# Altium schematic sheet main.SchDoc
size A4
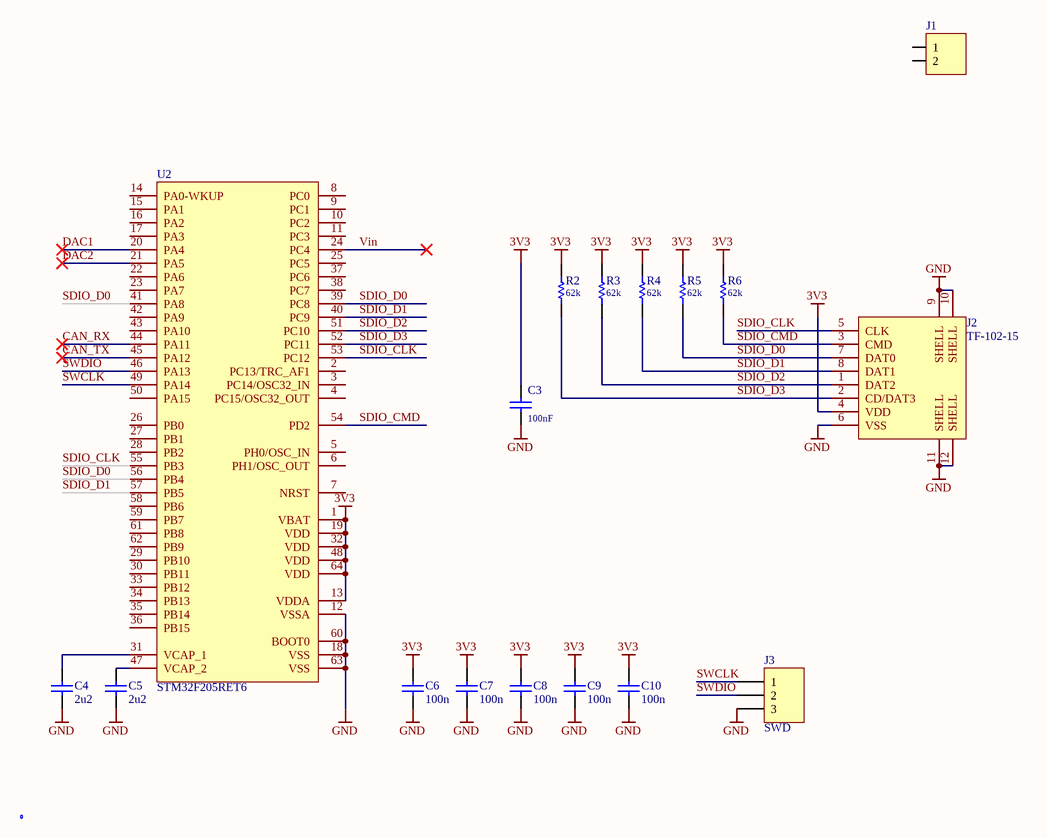
[diagram p0: main.SchDoc]

## Parts
C3  100nF  [C0402]
C4  2u2  [C0603]
C5  2u2  [C0603]
C6  100n  [C0402]
C7  100n  [C0402]
C8  100n  [C0402]
C9  100n  [C0402]
C10  100n  [C0402]
J1  (no value)  [HDR-1X2_2.54]  (no BOM)
J2  TF-102-15  [TF-SMD_TF-102-15]
J3  SWD  [HDR-1x3-P1.25]  (no BOM)
LOGO1  LOGO  [LOGO]  (value not drawn)  (graphical)
R2  62k  [R0402]
R3  62k  [R0402]
R4  62k  [R0402]
R5  62k  [R0402]
R6  62k  [R0402]
U2  STM32F205RET6  [LQFP-64]

## Nets
3V3: C3.2 C6.2 C7.2 C8.2 C9.2 C10.2 J2.4(VDD) R2.1 R3.1 R4.1 R5.1 R6.1 U2.1(VBAT) U2.13(VDDA) U2.19(VDD) U2.32(VDD) U2.48(VDD) U2.64(VDD)
GND: C3.1 C4.1 C5.1 C6.1 C7.1 C8.1 C9.1 C10.1 J2.6(VSS) J2.9(SHELL) J2.10(SHELL) J2.11(SHELL) J2.12(SHELL) J3.3 U2.12(VSSA) U2.18(VSS) U2.60(BOOT0) U2.63(VSS)
CAN_RX: U2.44(PA11)
CAN_TX: U2.45(PA12)
DAC1: U2.20(PA4)
DAC2: U2.21(PA5)
SDIO_CLK: J2.5(CLK) U2.53(PC12) U2.55(PB3)
SDIO_CMD: J2.3(CMD) R6.2 U2.54(PD2)
SDIO_D0: J2.7(DAT0) R5.2 U2.39(PC8) U2.41(PA8) U2.56(PB4)
SDIO_D1: J2.8(DAT1) R4.2 U2.40(PC9) U2.57(PB5)
SDIO_D2: J2.1(DAT2) R3.2 U2.51(PC10)
SDIO_D3: J2.2(CD/DAT3) R2.2 U2.52(PC11)
SWCLK: J3.1 U2.49(PA14)
SWDIO: J3.2 U2.46(PA13)
Vin: U2.24(PC4)
NetC4_2: C4.2 U2.31(VCAP_1)
NetC5_2: C5.2 U2.47(VCAP_2)

Not connected (* = marked no-connect by the designer): J1 1 2; U2 2(PC13/TRC_AF1) 3(PC14/OSC32_IN) 4(PC15/OSC32_OUT) 5(PH0/OSC_IN) 6(PH1/OSC_OUT) 7(NRST) 8(PC0) 9(PC1) 10(PC2) 11(PC3) 14(PA0-WKUP) 15(PA1) 16(PA2) 17(PA3) 22(PA6) 23(PA7) 25(PC5) 26(PB0) 27(PB1) 28(PB2) 29(PB10) 30(PB11) 33(PB12) 34(PB13) 35(PB14) 36(PB15) 37(PC6) 38(PC7) 42(PA9) 43(PA10) 50(PA15) 58(PB6) 59(PB7) 61(PB8) 62(PB9)

## Library data of the parts
C3 = CAP: P/N: CC0402KRX7R9BB104; LCSC part number: C131394
C4-C10 = Cap
J1 = Header 2
J3 = Header 3
R2-R6 = RES_0402_1K5-1%
U2 = STM32F205RET6: Manufacturer: ST(意法半导体); Add into BOM: yes; CPU Core: ARM-M3; CPU Maximum Speed: 120MHz; Program Storage Size: 512KB; Program Memory Type: FLASH; Number of I/O: 51; ADC (Bit): 12bit; Voltage - Supply: 1.8V~3.6V; Symbol: STM32F205RET6; Device: STM32F205RET6; LCSC Part Name: 高性能ARM Cortex-M3 MCU，具有512 KB Flash、120 MHz CPU和ART加速器; Supplier Part: C66278; Manufacturer Part: STM32F205RET6; Supplier Footprint: LQFP-64(10x10); JLCPCB Part Class: Extended Part; Datasheet: https://item.szlcsc.com/datasheet/STM32F205RET6/67362.html; Supplier: LCSC; Convert to PCB: yes; DAC (Bit): 12bit; Applications: -